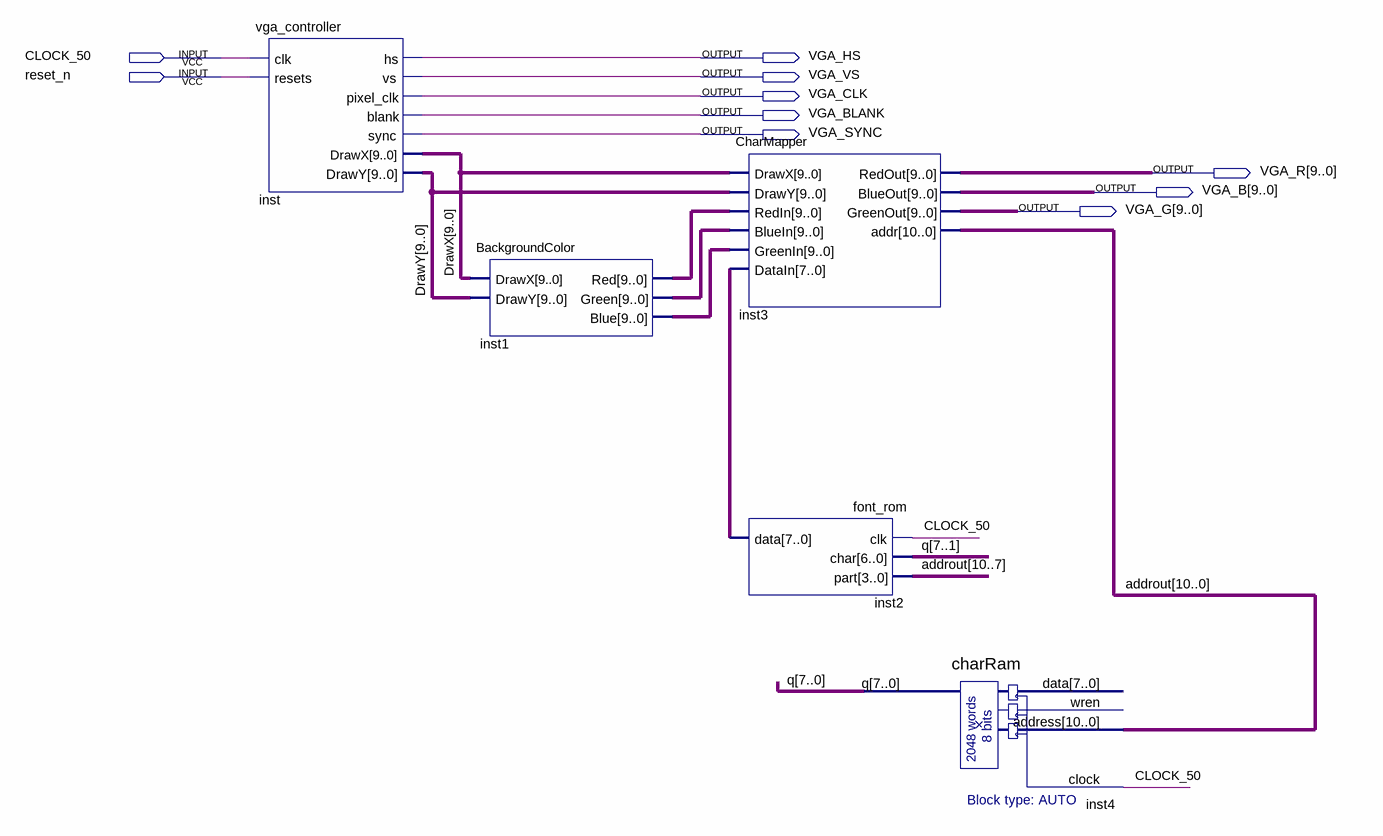
[diagram p0: schematic sheet]
// Quartus schematic VideoController.bdf as structural Verilog: 5 symbols, 10 pins
module VideoController (
  input  CLOCK_50,
  input  reset_n,
  output VGA_HS,
  output VGA_VS,
  output VGA_CLK,
  output VGA_BLANK,
  output VGA_SYNC,
  output [9:0] VGA_R,
  output [9:0] VGA_B,
  output [9:0] VGA_G
);

  wire [7:0] inst2_data, q;
  wire [9:0] DrawX, DrawY, inst1_blue, inst1_green, inst1_red;
  wire [10:0] addrout;

  vga_controller inst (
    .clk(CLOCK_50), .resets(reset_n), .hs(VGA_HS), .vs(VGA_VS), .pixel_clk(VGA_CLK), .blank(VGA_BLANK),
    .sync(VGA_SYNC), .DrawX(DrawX), .DrawY(DrawY));
  BackgroundColor inst1 (.DrawX(DrawX), .DrawY(DrawY), .Red(inst1_red), .Green(inst1_green), .Blue(inst1_blue));
  CharMapper inst3 (
    .DrawX(DrawX), .DrawY(DrawY), .RedIn(inst1_red), .BlueIn(inst1_green), .GreenIn(inst1_blue),
    .DataIn(inst2_data), .RedOut(VGA_R), .BlueOut(VGA_B), .GreenOut(VGA_G), .addr(addrout));
  font_rom inst2 (.clk(CLOCK_50), .char(q[7:1]), .part(addrout[10:7]), .data(inst2_data));
  charRam inst4 (.address(addrout), .clock(CLOCK_50), .q(q));  // open: data, wren
endmodule
